# Altium schematic sheet HMC478-SCH.SchDoc
size A4
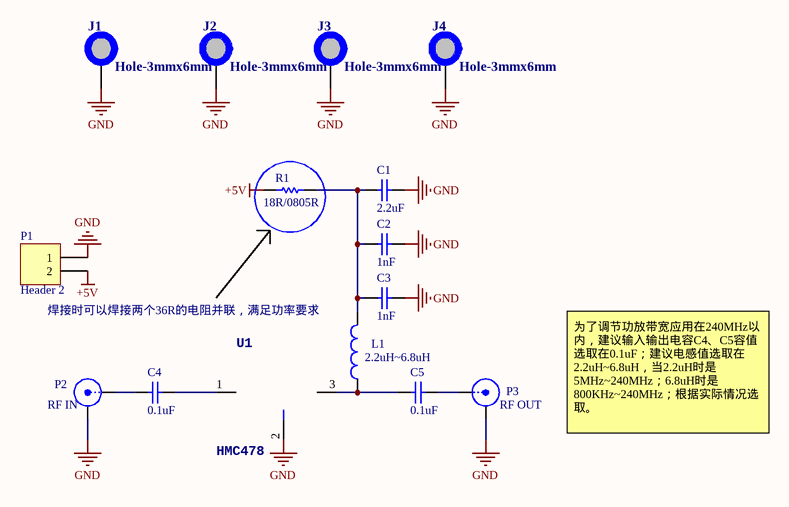
[diagram p0: HMC478-SCH.SchDoc]

## Parts
C1  2.2uF  [1206T]
C2  1nF  [0603C]
C3  1nF  [0603C]
C4  0.1uF  [0603C]
C5  0.1uF  [0603C]
J1  Hole-3mmx6mm  [Hole]
J2  Hole-3mmx6mm  [Hole]
J3  Hole-3mmx6mm  [Hole]
J4  Hole-3mmx6mm  [Hole]
L1  2.2uH~6.8uH  [0603L]
P1  Header 2  [KF2EDG_3R81_2P]
P2  RF IN  [SMA-SMD]
P3  RF OUT  [SMA-SMD]
R1  18R/0805R  [0805R]
U1  HMC478  [SOT89]

## Nets
+5V: P1.2 R1.1
GND: C1.2 C2.2 C3.2 J1.0 J2.0 J3.0 J4.0 P1.1 P2.2(Y) P3.2(Y) U1.2(GND)
NetC1_1: C1.1 C2.1 C3.1 L1.2 R1.2
NetC4_1: C4.1 P2.1(X)
NetC4_2: C4.2 U1.1(RF_IN)
NetC5_1: C5.1 L1.1 U1.3(RF_OUT)
NetC5_2: C5.2 P3.1(X)

## Notes on the sheet
- (near P1) 焊接时可以焊接两个36R的电阻并联，满足功率要求
- 为了调节功放带宽应用在240MHz以内，建议输入输出电容C4、C5容值选取在0.1uF；建议电感值选取在2.2uH~6.8uH，当2.2uH时是5MHz~240MHz；6.8uH时是800KHz~240MHz；根据实际情况选取。

## Library data of the parts
C1-C5 = Cap1: CAP CER 10000PF 100V X7R 0603; Manufacturer: TDK Corporation; Manufacturer Part Number: C1608X7R2A103K080AA; Tolerance: ±10%; Notification: Current market demand for these product types have resulted in fluctuating and extending lead times. Lead times may differ.; Supplier 1: Digi-Key; RoHS: RoHS Compliant; Category: Capacitors; Stock 1: 40000; Pricing 1: 4000=0.01438 (USD); Packaging: Tape & Reel (TR); Part Status: Active; Voltage - Rated: 100V; Temperature Coefficient: X7R; Operating Temperature: -55°C ~ 125°C; Features: -; Ratings: -; Applications: General Purpose; Failure Rate: -; Mounting Type: Surface Mount, MLCC; Package / Case: 0603 (1608 Metric); Size / Dimension: 0.063" L x 0.032" W (1.60mm x 0.80mm); Height - Seated (Max): -; Thickness (Max): 0.035" (0.90mm); Lead Spacing: -; Lead Style: -; ComponentLink1URL: https://product.tdk.com/info/en/catalog/datasheets/mlcc_commercial_midvoltage_en.pdf; ComponentLink1Description: https://product.tdk.com/info/en/catalog/datasheets/mlcc_commercial_midvoltage_en.pdf; Supplier Part Number 1: 445-1304-2-ND
  C1: Value: 2.2uF
  C2 C3: Value: 1nF
  C4 C5: Value: 0.1uF
J1-J4 = HOLED
L1 = Inductors: FIXED IND 240NH 4.4A 22MOHM SMD; Manufacturer: Samsung Electro-Mechanics; Manufacturer Part Number: CIGT201210UHR24MNE; Type: Thin Film; Material - Core: Metal Composite; Tolerance: ±20%; Current - Saturation: 6.6A; Shielding: Unshielded; DC Resistance (DCR): 22 mOhm Max; Supplier 1: Digi-Key; RoHS: RoHS Compliant; Category: Inductors, Coils, Chokes; Stock 1: 17555; Pricing 1: 1=0.26, 10=0.23, 100=0.1579, 500=0.13492, 1000=0.10334 (USD); Packaging: Cut Tape (CT); Part Status: Active; Q @ Freq: -; Frequency - Self Resonant: -; Ratings: -; Operating Temperature: -40°C ~ 125°C; Features: -; Mounting Type: Surface Mount; Package / Case: 0805 (2012 Metric); Supplier Device Package: 0603 (1608 Metric); Size / Dimension: 0.079" L x 0.049" W (2.00mm x 1.25mm); Height - Seated (Max): 0.039" (1.00mm); ComponentLink1URL: http://www.samsungsem.com/kr/support/product-search/inductor/CIGT201210UHR24MNE.jsp; ComponentLink1Description: http://www.samsungsem.com/kr/support/product-search/inductor/CIGT201210UHR24MNE.jsp; Supplier Part Number 1: 1276-6890-1-ND; Value: 2.2uH~6.8uH
P1 = Header 2: Header, 2-Pin; LatestRevisionDate: 17-Jul-2002; LatestRevisionNote: Re-released for DXP Platform.; Publisher: Altium Limited
P2 P3 = BNC: BNC Elbow Connector; LatestRevisionDate: 17-Jul-2002; LatestRevisionNote: Re-released for DXP Platform.; Publisher: Altium Limited
R1 = Res1: RES SMD 1K OHM 0.5% 1/16W 0603; Manufacturer: Susumu; Manufacturer Part Number: RR0816P-102-D; Power (Watts): 0.063W, 1/16W; Temperature Coefficient: ±25ppm/°C; Supplier 1: Digi-Key; RoHS: RoHS Compliant; Category: Resistors; Stock 1: 1648842; Pricing 1: 1=0.13, 10=0.122, 100=0.0483, 1000=0.0225, 2500=0.01973 (USD); Packaging: Digi-Reel?; Part Status: Active; Tolerance: ±0.5%; Composition: Thin Film; Features: -; Operating Temperature: -55°C ~ 125°C; Package / Case: 0603 (1608 Metric); Supplier Device Package: -; Size / Dimension: 0.063" L x 0.032" W (1.60mm x 0.80mm); Height - Seated (Max): 0.020" (0.50mm); Failure Rate: -; ComponentLink1URL: http://www.susumu.co.jp/common/pdf/n_catalog_partition05_en.pdf; ComponentLink1Description: http://www.susumu.co.jp/common/pdf/n_catalog_partition05_en.pdf; Supplier Part Number 1: RR08P1.0KDDKR-ND; Value: 18R/0805R
U1 = HMC478: SiGe HBT GAIN BLOCK  MMIC AMPLIFIER, DC - 4 GHz